# Altium schematic sheet FUNCTION GENERATOR.SchDoc
size A4
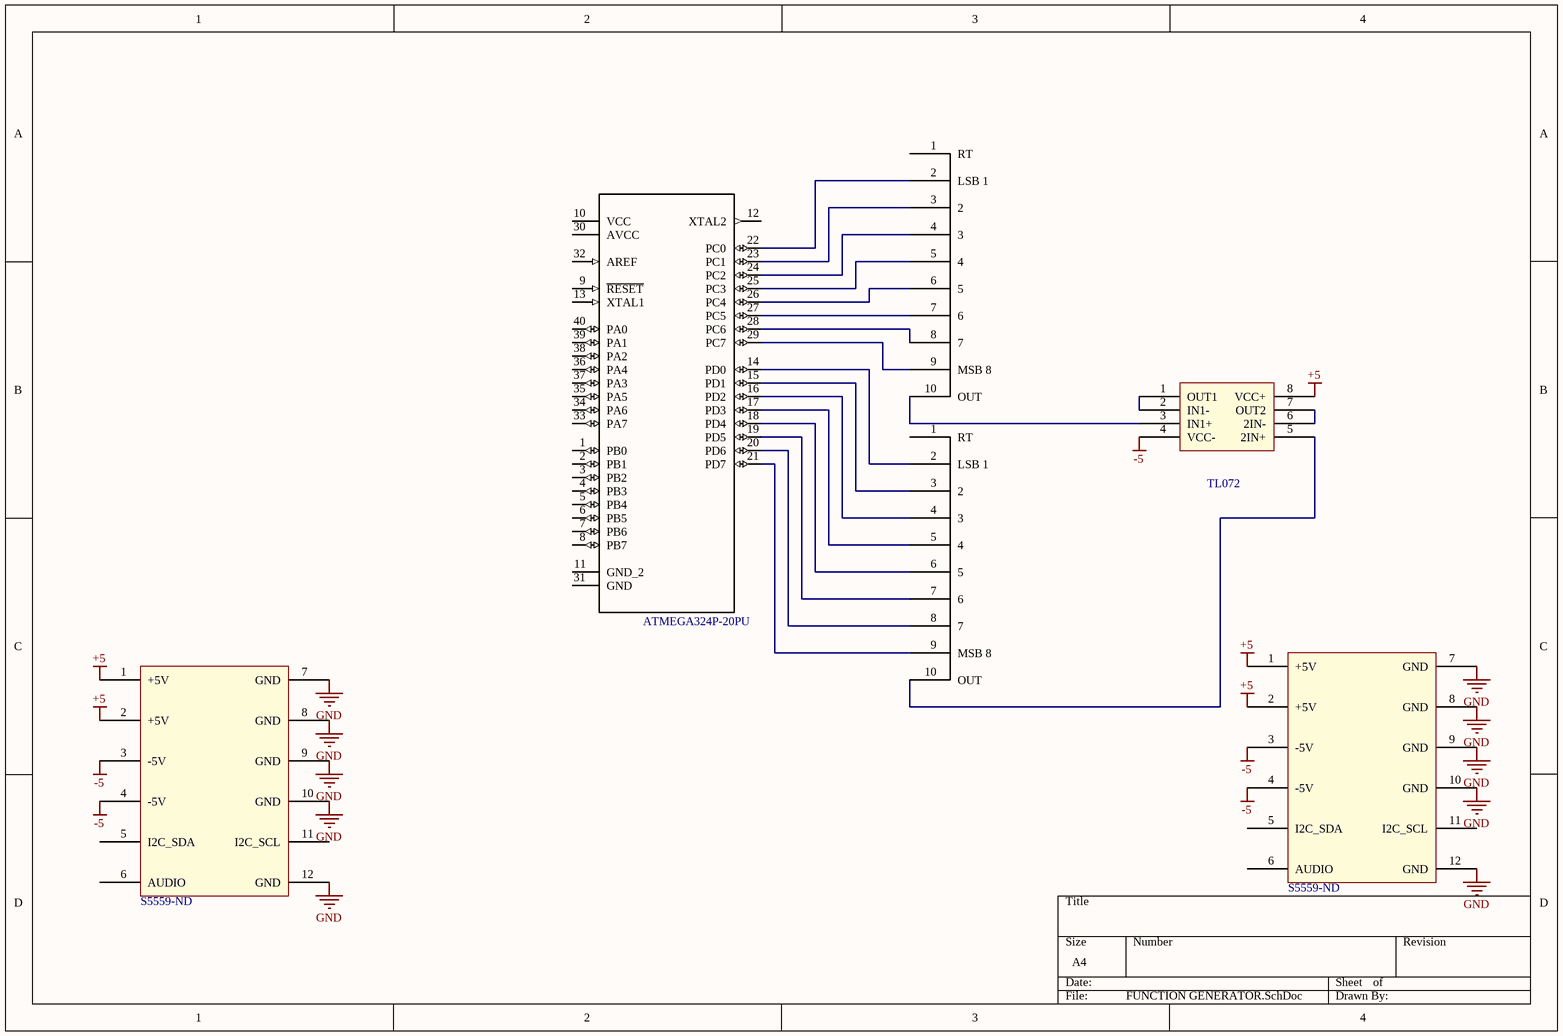
[diagram p0: FUNCTION GENERATOR.SchDoc]

## Parts
(Parts that share a designator on the sheet are numbered #1, #2 ... from top to bottom, then left to right.)
1  RT  [R2R]  (value not drawn)
2  RT  [R2R]  (value not drawn)
*#1  S5559-ND
*#2  S5559-ND
U?#1  ATMEGA324P-20PU  [DIP254P1524X482-40]
U?#2  TL072  [DIP794W45P254L1060H508Q8]  (part A of 2)

## Nets
+5: *#1.1(+5V) *#1.2(+5V) *#2.1(+5V) *#2.2(+5V) U?#2.8(VCC+)
-5: *#1.3(-5V) *#1.4(-5V) *#2.3(-5V) *#2.4(-5V) U?#2.4(VCC-)
GND: *#1.7(GND) *#1.8(GND) *#1.9(GND) *#1.10(GND) *#1.12(GND) *#2.7(GND) *#2.8(GND) *#2.9(GND) *#2.10(GND) *#2.12(GND)
Net1_2: 1.2(LSB_1) U?#1.22(PC0)
Net1_3: 1.3(2) U?#1.23(PC1)
Net1_4: 1.4(3) U?#1.24(PC2)
Net1_5: 1.5(4) U?#1.25(PC3)
Net1_6: 1.6(5) U?#1.26(PC4)
Net1_7: 1.7(6) U?#1.27(PC5)
Net1_8: 1.8(7) U?#1.28(PC6)
Net1_9: 1.9(MSB_8) U?#1.29(PC7)
Net1_10: 1.10(OUT) U?#2.3(IN1+)
Net2_2: 2.2(LSB_1) U?#1.14(PD0)
Net2_3: 2.3(2) U?#1.15(PD1)
Net2_4: 2.4(3) U?#1.16(PD2)
Net2_5: 2.5(4) U?#1.17(PD3)
Net2_6: 2.6(5) U?#1.18(PD4)
Net2_7: 2.7(6) U?#1.19(PD5)
Net2_8: 2.8(7) U?#1.20(PD6)
Net2_9: 2.9(MSB_8) U?#1.21(PD7)
Net2_10: 2.10(OUT) U?#2.5(2IN+)
NetU?#2_1: U?#2.1(OUT1) U?#2.2(IN1-)
NetU?#2_6: U?#2.6(2IN-) U?#2.7(OUT2)

Not connected (* = marked no-connect by the designer): 1 1(RT); 2 1(RT); *#1 5(I2C_SDA) 6(AUDIO) 11(I2C_SCL); *#2 5(I2C_SDA) 6(AUDIO) 11(I2C_SCL); U?#1 1(PB0) 2(PB1) 3(PB2) 4(PB3) 5(PB4) 6(PB5) 7(PB6) 8(PB7) 9(~{RESET}) 10(VCC) 11(GND_2) 12(XTAL2) 13(XTAL1) 30(AVCC) 31(GND) 32(AREF) 33(PA7) 34(PA6) 35(PA5) 36(PA4) 37(PA3) 38(PA2) 39(PA1) 40(PA0)

## Library data of the parts
1 2 = R2R
U?#1 = ATMEGA324P-20PU: ATmega Series 20 MHz 32 KB Flash 2 KB SRAM 8-Bit Microcontroller - DIP-40; MF: Microchip; SnapEDA_Link: https://www.snapeda.com/parts/ATMEGA324P-20PU/Microchip/view-part/?ref=snap; Availability: Unavailable; MP: ATMEGA324P-20PU; Price: None; Package: DIP-40 Microchip; Value: *
U?#2 = TL072: Wide Bandwidth Dual JFET Input Operational Amplifier 8-PDIP 0 to 70; MF: Texas Instruments; Price: None; MP: TL072; SnapEDA_Link: https://www.snapeda.com/parts/TL072/Texas%2520Instruments/view-part/?ref=snap; Package: None; Availability: Unavailable; Value: *